# Altium schematic sheet Sheet1.SchDoc
size A3
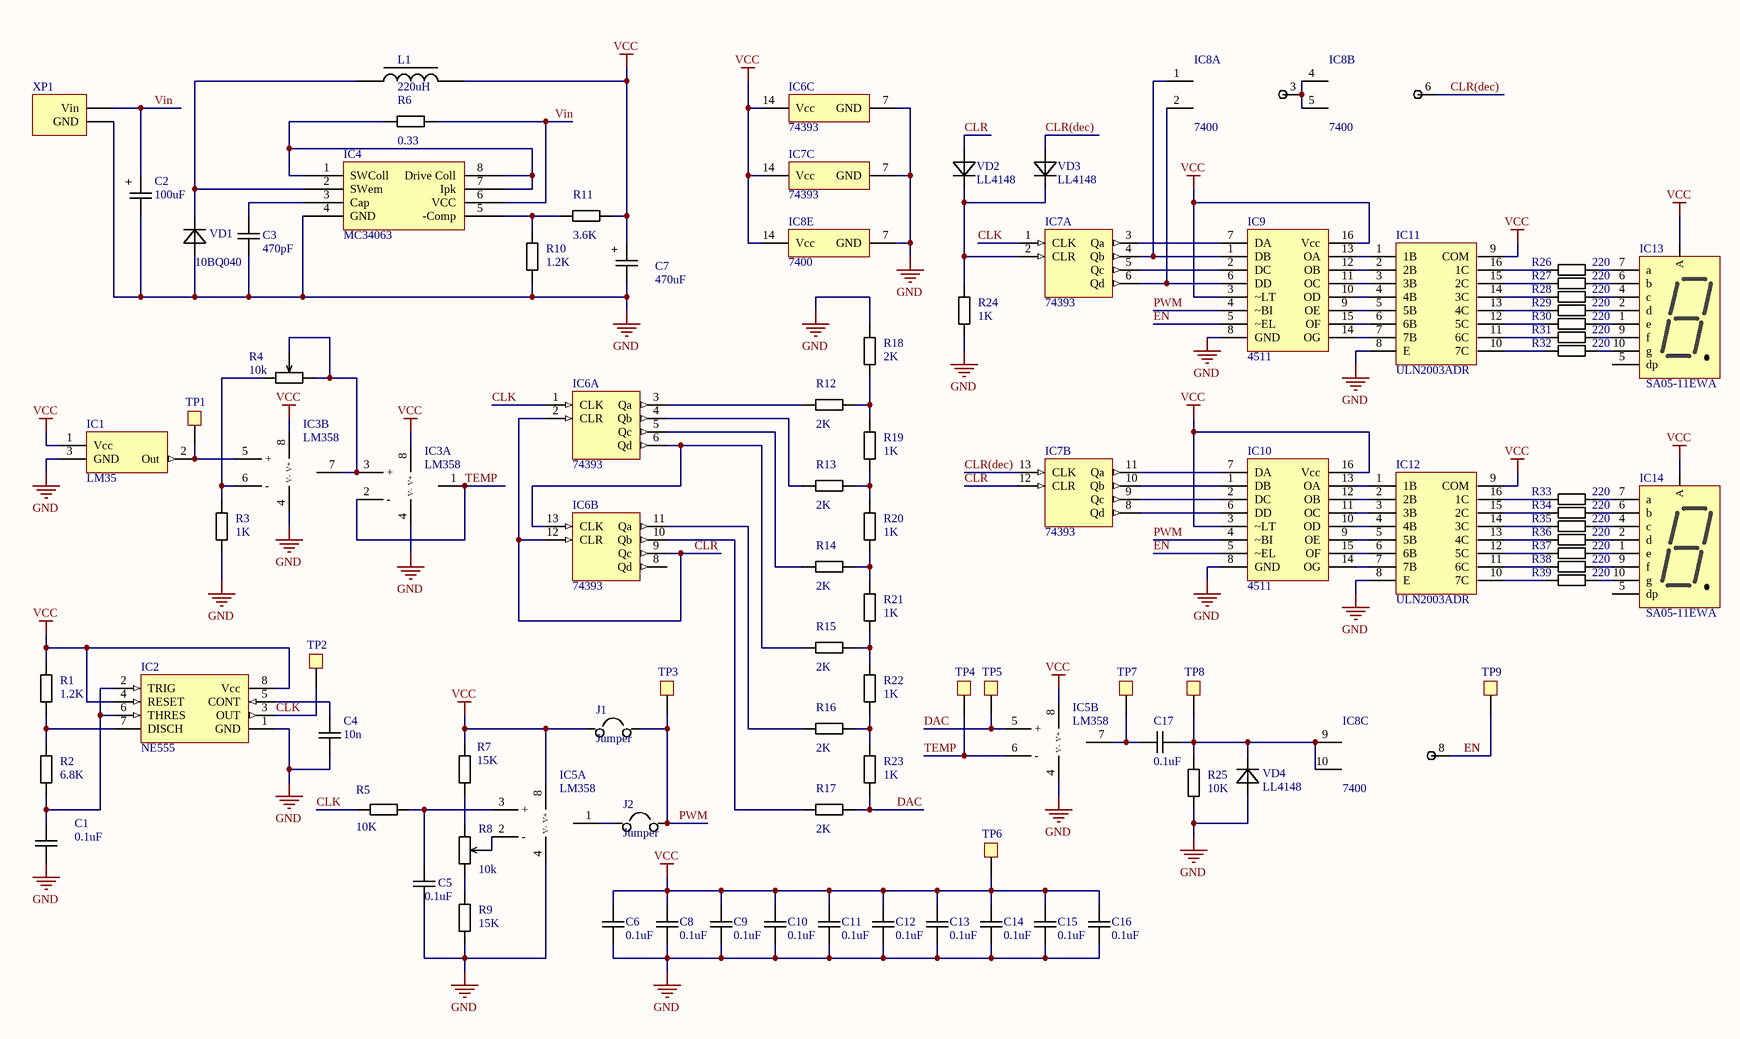
[diagram p0: Sheet1.SchDoc]

## Parts
C1  0.1uF  [CAP0805]
C2  100uF  [CAP-SMD-E]
C3  470pF  [CAP0805]
C4  10n  [CAP0805]
C5  0.1uF  [CAP0805]
C6  0.1uF  [CAP0805]
C7  470uF  [CAP-SMD-E]
C8  0.1uF  [CAP0805]
C9  0.1uF  [CAP0805]
C10  0.1uF  [CAP0805]
C11  0.1uF  [CAP0805]
C12  0.1uF  [CAP0805]
C13  0.1uF  [CAP0805]
C14  0.1uF  [CAP0805]
C15  0.1uF  [CAP0805]
C16  0.1uF  [CAP0805]
C17  0.1uF  [CAP0805]
IC1  LM35  [TO92]
IC2  NE555  [SOIC8]
IC3  LM358  [SOIC8]  (parts A,B of 2)
IC4  MC34063  [SOIC8]
IC5  LM358  [SOIC8]  (parts A,B of 2)
IC6  74393  [SOIC-14(3.9mm)]  (parts A,B,C of 3)
IC7  74393  [SOIC-14(3.9mm)]  (parts A,B,C of 3)
IC8  7400  [SOIC-14(3.9mm)]  (parts A,B,C,E of 5)
IC9  4511  [DIP16]
IC10  4511  [DIP16]
IC11  ULN2003ADR  [SOIC16]
IC12  ULN2003ADR  [SOIC16]
IC13  SA05-11EWA  [SA05-11EWA]
IC14  SA05-11EWA  [SA05-11EWA]
J1  Jumper  [RES0805]
J2  Jumper  [RES0805]
L1  220uH  [LQH55]
R1  1.2K  [RES0805]
R2  6.8K  [RES0805]
R3  1K  [RES0805]
R4  10k  [POT]
R5  10K  [RES0805]
R6  0.33  [RES0805]
R7  15K  [RES0805]
R8  10k  [POT]
R9  15K  [RES0805]
R10  1.2K  [RES0805]
R11  3.6K  [RES0805]
R12  2K  [RES0805]
R13  2K  [RES0805]
R14  2K  [RES0805]
R15  2K  [RES0805]
R16  2K  [RES0805]
R17  2K  [RES0805]
R18  2K  [RES0805]
R19  1K  [RES0805]
R20  1K  [RES0805]
R21  1K  [RES0805]
R22  1K  [RES0805]
R23  1K  [RES0805]
R24  1K  [RES0805]
R25  10K  [RES0805]
R26  220  [RES0805]
R27  220  [RES0805]
R28  220  [RES0805]
R29  220  [RES0805]
R30  220  [RES0805]
R31  220  [RES0805]
R32  220  [RES0805]
R33  220  [RES0805]
R34  220  [RES0805]
R35  220  [RES0805]
R36  220  [RES0805]
R37  220  [RES0805]
R38  220  [RES0805]
R39  220  [RES0805]
TP1  TestPoint  [TP]  (value not drawn)
TP2  TestPoint  [TP]  (value not drawn)
TP3  TestPoint  [TP]  (value not drawn)
TP4  TestPoint  [TP]  (value not drawn)
TP5  TestPoint  [TP]  (value not drawn)
TP6  TestPoint  [TP]  (value not drawn)
TP7  TestPoint  [TP]  (value not drawn)
TP8  TestPoint  [TP]  (value not drawn)
TP9  TestPoint  [TP]  (value not drawn)
VD1  10BQ040  [DIODESMB]
VD2  LL4148  [DIOMELF]
VD3  LL4148  [DIOMELF]
VD4  LL4148  [DIOMELF]
XP1  XP  [XP]  (value not drawn)

## Nets
GND: C1.2 C2.C C3.2 C4.1 C5.1 C6.1 C7.C C8.1 C9.1 C10.1 C11.1 C12.1 C13.1 C14.1 C15.1 C16.1 IC1.3(GND) IC2.1(GND) IC3.4(V-) IC4.4(GND) IC5.4(V-) IC6.7(GND) IC7.7(GND) IC8.7(GND) IC9.8(GND) IC10.8(GND) IC11.8(E) IC12.8(E) R3.1 R9.2 R10.1 R18.2 R24.1 R25.1 VD1.A VD4.A XP1.G(GND)
VCC: C6.2 C7.A C8.2 C9.2 C10.2 C11.2 C12.2 C13.2 C14.2 C15.2 C16.2 IC1.1(Vcc) IC2.4(RESET) IC2.8(Vcc) IC3.8(V+) IC5.8(V+) IC6.14(Vcc) IC7.14(Vcc) IC8.14(Vcc) IC9.3(~LT) IC9.16(Vcc) IC10.3(~LT) IC10.16(Vcc) IC11.9(COM) IC12.9(COM) IC13.A IC14.A J1.1 L1.2 R1.2 R7.1 R11.1 TP6.0
CLK: IC2.3(OUT) IC6.1(CLK) IC7.1(CLK) R5.2 TP2.0
CLR: IC6.2(CLR) IC6.9(Qc) IC6.12(CLR) IC7.12(CLR) VD2.A
CLR(dec): IC7.13(CLK) IC8.6(2Y) VD3.A
DAC: IC5.5(+) R17.2 R23.1 TP5.0
EN: IC8.8(3Y) IC9.5(~EL) IC10.5(~EL) TP9.0
PWM: IC9.4(~BI) IC10.4(~BI) J1.2 J2.2 TP3.0
TEMP: IC3.1(Q1) IC3.2(-) IC5.6(-) TP4.0
Vin: C2.A IC4.6(VCC) R6.2 XP1.V(Vin)
NetC1_1: C1.1 IC2.2(TRIG) IC2.6(THRES) R2.1
NetC3_1: C3.1 IC4.3(Cap)
NetC4_2: C4.2 IC2.5(CONT)
NetC5_2: C5.2 IC5.3(+) R5.1
NetC17_1: C17.1 IC5.7(Q2) TP7.0
NetC17_2: C17.2 IC8.9(3A) IC8.10(3B) R25.2 TP8.0 VD4.C
NetIC1_2: IC1.2(Out) IC3.5(+) TP1.0
NetIC2_7: IC2.7(DISCH) R1.1 R2.2
NetIC3_3: IC3.3(+) IC3.7(Q2) R4.2 R4.3
NetIC3_6: IC3.6(-) R3.2 R4.1
NetIC4_1: IC4.1(SWColl) IC4.7(Ipk) IC4.8(Drive_Coll) R6.1
NetIC4_2: IC4.2(SWem) L1.1 VD1.C
NetIC4_5: IC4.5(-Comp) R10.2 R11.2
NetIC5_1: IC5.1(Q1) J2.1
NetIC5_2: IC5.2(-) R8.3
NetIC6_3: IC6.3(Qa) R12.1
NetIC6_4: IC6.4(Qb) R13.1
NetIC6_5: IC6.5(Qc) R14.1
NetIC6_6: IC6.6(Qd) IC6.13(CLK) R15.1
NetIC6_10: IC6.10(Qb) R17.1
NetIC6_11: IC6.11(Qa) R16.1
NetIC7_2: IC7.2(CLR) R24.2 VD2.C VD3.C
NetIC7_3: IC7.3(Qa) IC9.7(DA)
NetIC7_4: IC7.4(Qb) IC8.1(1A) IC9.1(DB)
NetIC7_5: IC7.5(Qc) IC9.2(DC)
NetIC7_6: IC7.6(Qd) IC8.2(1B) IC9.6(DD)
NetIC7_8: IC7.8(Qd) IC10.6(DD)
NetIC7_9: IC7.9(Qc) IC10.2(DC)
NetIC7_10: IC7.10(Qb) IC10.1(DB)
NetIC7_11: IC7.11(Qa) IC10.7(DA)
NetIC8_3: IC8.3(1Y) IC8.4(2A) IC8.5(2B)
NetIC9_9: IC9.9(OE) IC11.5(5B)
NetIC9_10: IC9.10(OD) IC11.4(4B)
NetIC9_11: IC9.11(OC) IC11.3(3B)
NetIC9_12: IC9.12(OB) IC11.2(2B)
NetIC9_13: IC9.13(OA) IC11.1(1B)
NetIC9_14: IC9.14(OG) IC11.7(7B)
NetIC9_15: IC9.15(OF) IC11.6(6B)
NetIC10_9: IC10.9(OE) IC12.5(5B)
NetIC10_10: IC10.10(OD) IC12.4(4B)
NetIC10_11: IC10.11(OC) IC12.3(3B)
NetIC10_12: IC10.12(OB) IC12.2(2B)
NetIC10_13: IC10.13(OA) IC12.1(1B)
NetIC10_14: IC10.14(OG) IC12.7(7B)
NetIC10_15: IC10.15(OF) IC12.6(6B)
NetIC11_10: IC11.10(7C) R32.1
NetIC11_11: IC11.11(6C) R31.1
NetIC11_12: IC11.12(5C) R30.1
NetIC11_13: IC11.13(4C) R29.1
NetIC11_14: IC11.14(3C) R28.1
NetIC11_15: IC11.15(2C) R27.1
NetIC11_16: IC11.16(1C) R26.1
NetIC12_10: IC12.10(7C) R39.1
NetIC12_11: IC12.11(6C) R38.1
NetIC12_12: IC12.12(5C) R37.1
NetIC12_13: IC12.13(4C) R36.1
NetIC12_14: IC12.14(3C) R35.1
NetIC12_15: IC12.15(2C) R34.1
NetIC12_16: IC12.16(1C) R33.1
NetIC13_1: IC13.1(e) R30.2
NetIC13_2: IC13.2(d) R29.2
NetIC13_4: IC13.4(c) R28.2
NetIC13_6: IC13.6(b) R27.2
NetIC13_7: IC13.7(a) R26.2
NetIC13_9: IC13.9(f) R31.2
NetIC13_10: IC13.10(g) R32.2
NetIC14_1: IC14.1(e) R37.2
NetIC14_2: IC14.2(d) R36.2
NetIC14_4: IC14.4(c) R35.2
NetIC14_6: IC14.6(b) R34.2
NetIC14_7: IC14.7(a) R33.2
NetIC14_9: IC14.9(f) R38.2
NetIC14_10: IC14.10(g) R39.2
NetR7_2: R7.2 R8.1
NetR8_2: R8.2 R9.1
NetR12_2: R12.2 R18.1 R19.2
NetR13_2: R13.2 R19.1 R20.2
NetR14_2: R14.2 R20.1 R21.2
NetR15_2: R15.2 R21.1 R22.2
NetR16_2: R16.2 R22.1 R23.2

Not connected (* = marked no-connect by the designer): IC6 8(Qd); IC13 5(dp); IC14 5(dp)

## Notes on the sheet
- (in symbol Cap+) +

## Library data of the parts
C1 C3-C6 C8-C17 = Cap0805
C2 C7 = Cap+
J1 J2 = Jumper0805
L1 = Coil
R1-R3 R5-R7 R9-R39 = Res0805
R4 R8 = POT
VD1 = 10BQ040(diode)
VD2-VD4 = LL4148(diode)